# Altium schematic sheet 05.SchDoc
size 420 x 297 mm
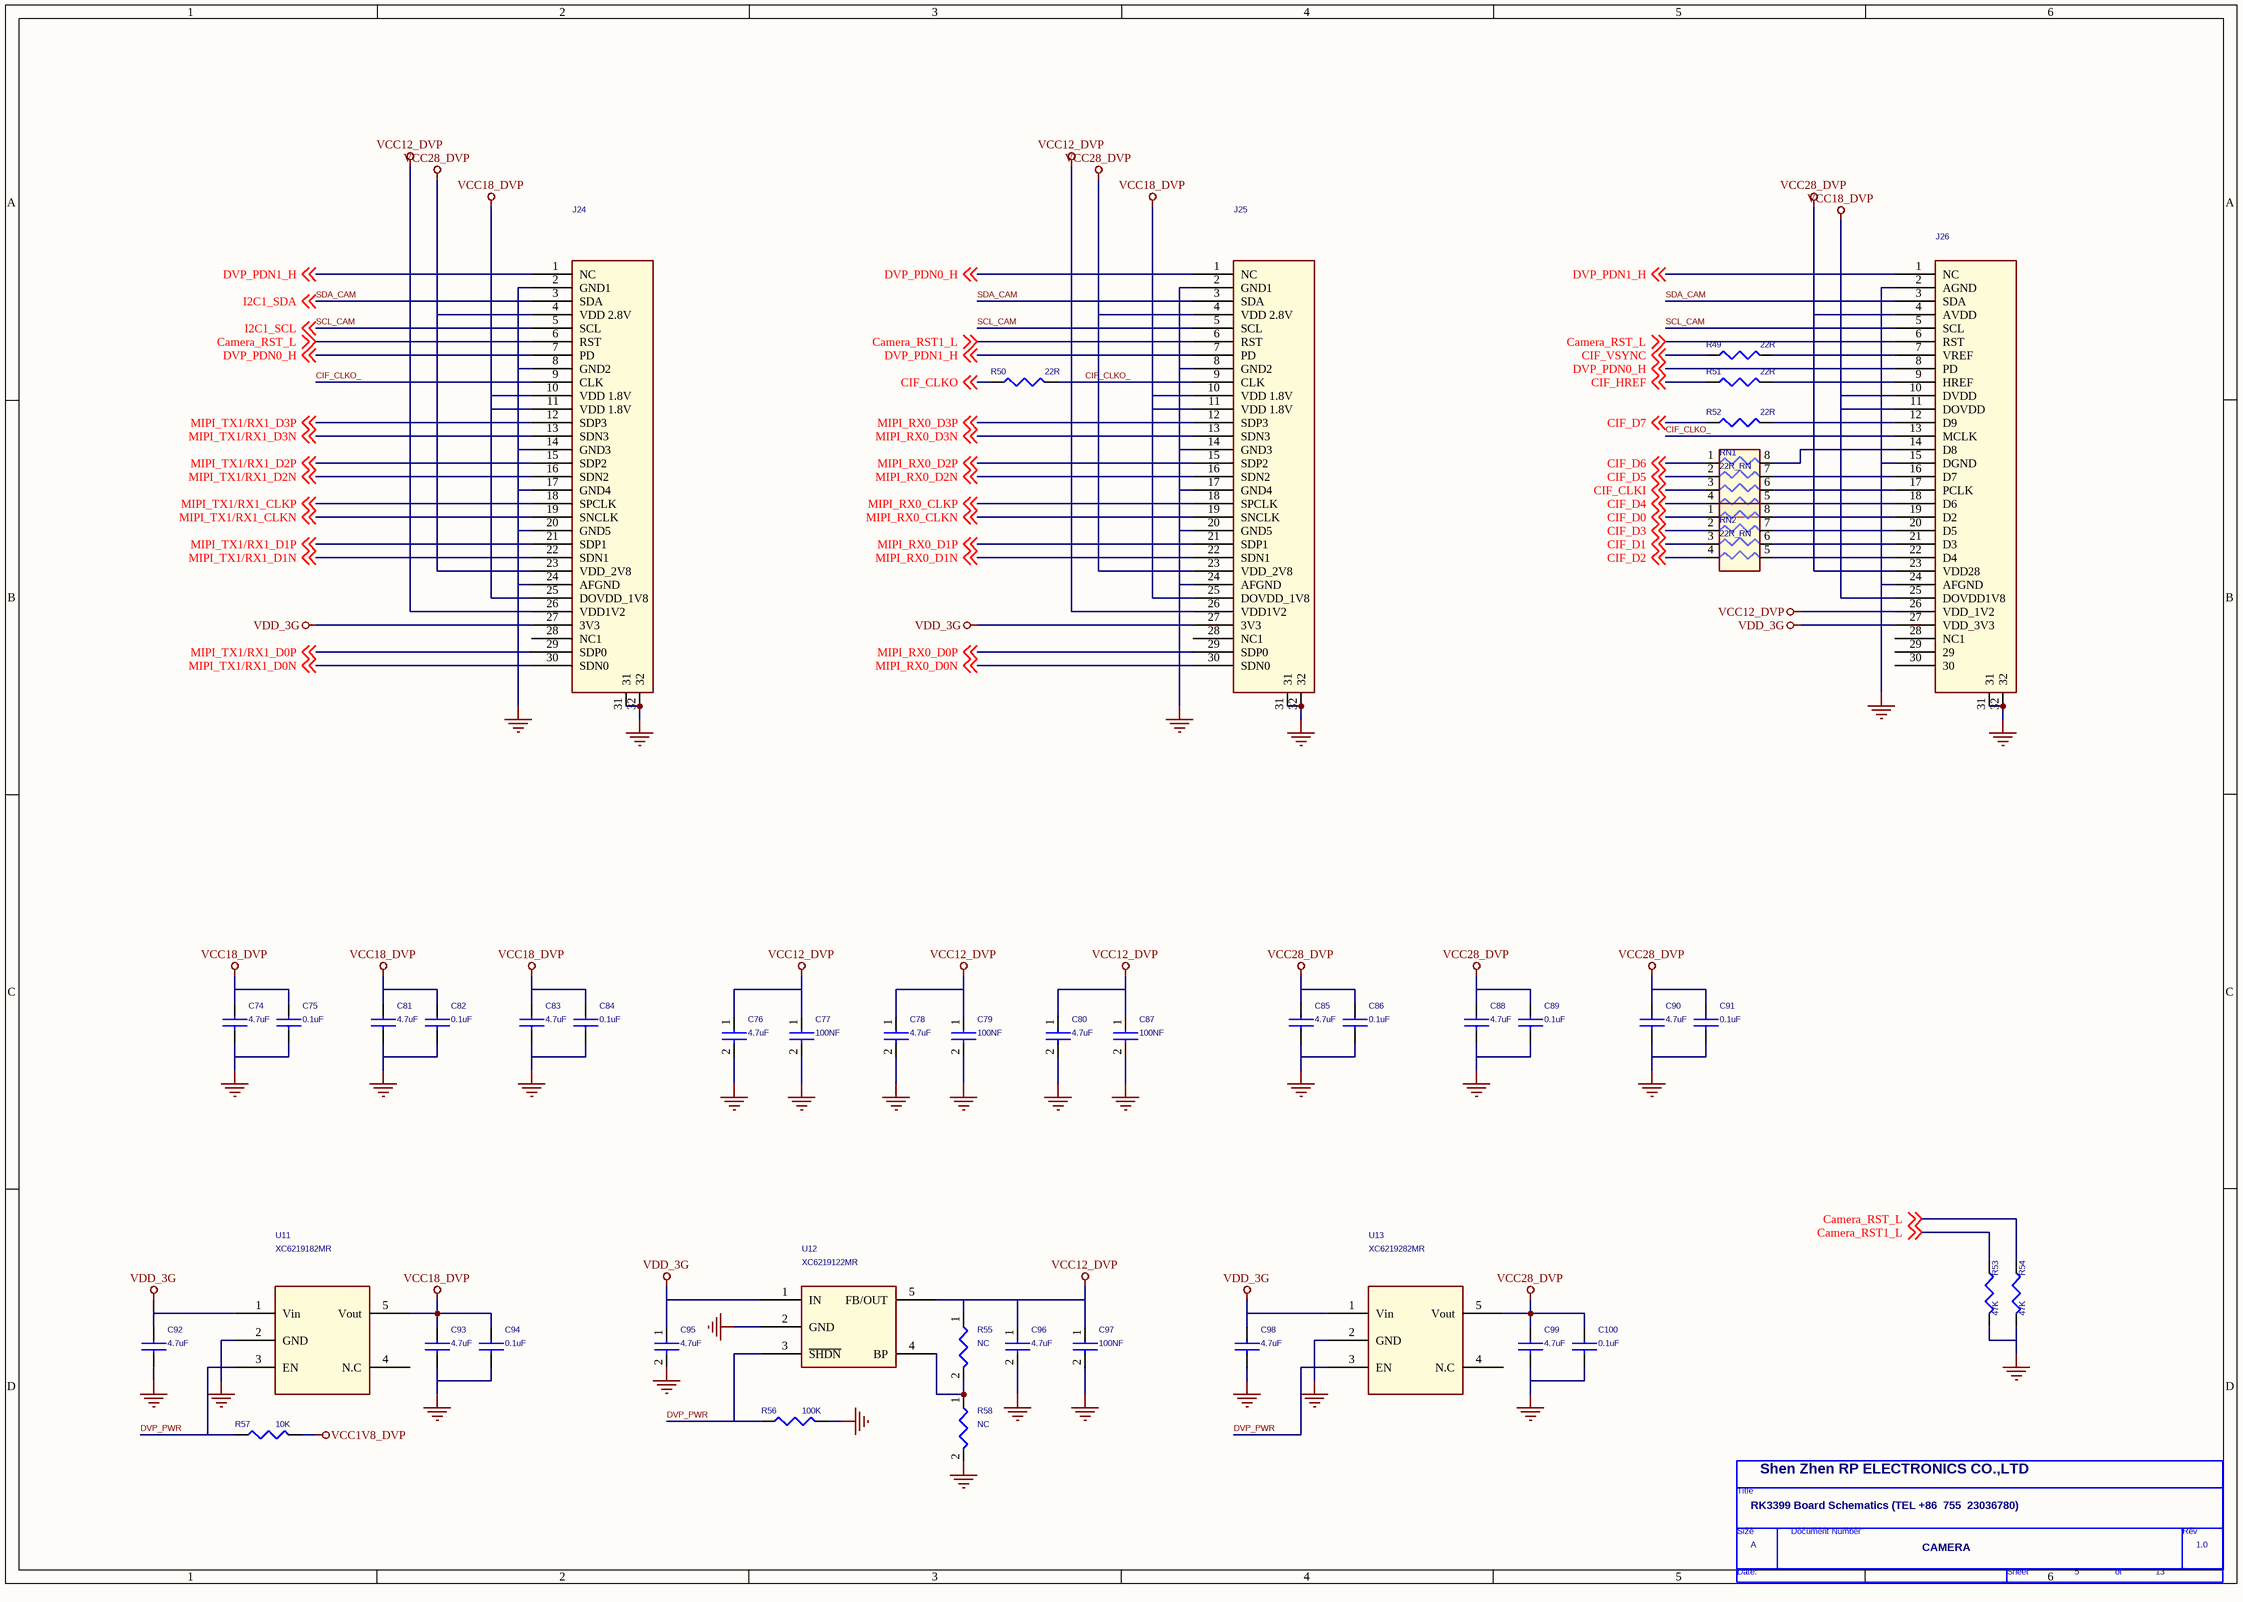
[diagram p0: 05.SchDoc]

## Parts
*  Doc: CAMERA  RevCode: 1.0  Title: RK3399 Board Schematics (TEL +86  755  23036780)  Page Size: A  Page Number: 5  Page Count: 13  Cage Code: Shen Zhen RP ELECTRONICS CO.,LTD  (hidden comment: TitleBlock0)  (graphical)
C74  4.7uF  [0402_cc]
C75  0.1uF  [0402_cc]
C76  4.7uF  [0402_cc]
C77  100NF  [0402_cc]
C78  4.7uF  [0402_cc]
C79  100NF  [0402_cc]
C80  4.7uF  [0402_cc]
C81  4.7uF  [0402_cc]
C82  0.1uF  [0402_cc]
C83  4.7uF  [0402_cc]
C84  0.1uF  [0402_cc]
C85  4.7uF  [0402_cc]
C86  0.1uF  [0402_cc]
C87  100NF  [0402_cc]
C88  4.7uF  [0402_cc]
C89  0.1uF  [0402_cc]
C90  4.7uF  [0402_cc]
C91  0.1uF  [0402_cc]
C92  4.7uF  [0402_cc]
C93  4.7uF  [0402_cc]
C94  0.1uF  [0402_cc]
C95  4.7uF  [0402_cc]
C96  4.7uF  [0402_cc]
C97  100NF  [0402_cc]
C98  4.7uF  [0402_cc]
C99  4.7uF  [0402_cc]
C100  0.1uF  [0402_cc]
J24  CAM-F  [FPC28_MICRO]  (value not drawn)
J25  CAM-M  [FPC28_MICRO]  (value not drawn)
J26  FPC30P  [FPC28_MICRO]  (value not drawn)
R49  22R  [0402_cc]
R50  22R  [0402_cc]
R51  22R  [0402_cc]
R52  22R  [0402_cc]
R53  47K  [0402_cc]
R54  47K  [0402_cc]
R55  NC  [R0402]
R56  100K  [0402_cc]
R57  10K  [0402_cc]
R58  NC  [R0402]
RN1  22R_RN  [R0402S4]
RN2  22R_RN  [R0402S4]
U11  XC6219182MR  [SOT23-5]
U12  XC6219122MR  [SOT_23_5]
U13  XC6219282MR  [SOT23-5]

## Nets
GND: C74.2 C75.2 C76.2 C77.2 C78.2 C79.2 C80.2 C81.2 C82.2 C83.2 C84.2 C85.2 C86.2 C87.2 C88.2 C89.2 C90.2 C91.2 C92.2 C93.2 C94.2 C95.2 C96.2 C97.2 C98.2 C99.2 C100.2 J24.2(GND1) J24.8(GND2) J24.14(GND3) J24.17(GND4) J24.20(GND5) J24.24(AFGND) J24.31 J24.32 J25.2(GND1) J25.8(GND2) J25.14(GND3) J25.17(GND4) J25.20(GND5) J25.24(AFGND) J25.31 J25.32 J26.2(AGND) J26.15(DGND) J26.24(AFGND) J26.31 J26.32 R53.2 R54.2 R56.2 R58.2 U11.2(GND) U12.2(GND) U13.2(GND)
VCC1V8_DVP: R57.2
VCC12_DVP: C76.1 C77.1 C78.1 C79.1 C80.1 C87.1 C96.1 C97.1 J24.26(VDD1V2) J25.26(VDD1V2) J26.26(VDD_1V2) R55.1 U12.5(FB/OUT)
VCC18_DVP: C74.1 C75.1 C81.1 C82.1 C83.1 C84.1 C93.1 C94.1 J24.10(VDD_1.8V) J24.11(VDD_1.8V) J24.25(DOVDD_1V8) J25.10(VDD_1.8V) J25.11(VDD_1.8V) J25.25(DOVDD_1V8) J26.10(DVDD) J26.11(DOVDD) J26.25(DOVDD1V8) U11.5(Vout)
VCC28_DVP: C85.1 C86.1 C88.1 C89.1 C90.1 C91.1 C99.1 C100.1 J24.4(VDD_2.8V) J24.23(VDD_2V8) J25.4(VDD_2.8V) J25.23(VDD_2V8) J26.4(AVDD) J26.23(VDD28) U13.5(Vout)
VDD_3G: C92.1 C95.1 C98.1 J24.27(3V3) J25.27(3V3) J26.27(VDD_3V3) U11.1(Vin) U12.1(IN) U13.1(Vin)
Camera_RST1_L: J25.6(RST) R53.1 ; off-sheet Camera_RST1_L
Camera_RST_L: J24.6(RST) J26.6(RST) R54.1 ; off-sheet Camera_RST_L
CIF_CLKI: RN1.3 ; off-sheet CIF_CLKI
CIF_CLKO: R50.2 ; off-sheet CIF_CLKO
CIF_CLKO_: J24.9(CLK) J25.9(CLK) J26.13(MCLK) R50.1
CIF_D0: RN2.1 ; off-sheet CIF_D0
CIF_D1: RN2.3 ; off-sheet CIF_D1
CIF_D2: RN2.4 ; off-sheet CIF_D2
CIF_D3: RN2.2 ; off-sheet CIF_D3
CIF_D4: RN1.4 ; off-sheet CIF_D4
CIF_D5: RN1.2 ; off-sheet CIF_D5
CIF_D6: RN1.1 ; off-sheet CIF_D6
CIF_D7: R52.2 ; off-sheet CIF_D7
CIF_HREF: R51.2 ; off-sheet CIF_HREF
CIF_VSYNC: R49.2 ; off-sheet CIF_VSYNC
DVP_PDN0_H: J24.7(PD) J25.1(NC) J26.8(PD) ; off-sheet DVP_PDN0_H
DVP_PDN1_H: J24.1(NC) J25.7(PD) J26.1(NC) ; off-sheet DVP_PDN1_H
DVP_PWR: R56.1 R57.1 U11.3(EN) U12.3(~{SHDN}) U13.3(EN)
MIPI_RX0_CLKN: J25.19(SNCLK) ; off-sheet MIPI_RX0_CLKN
MIPI_RX0_CLKP: J25.18(SPCLK) ; off-sheet MIPI_RX0_CLKP
MIPI_RX0_D0N: J25.30(SDN0) ; off-sheet MIPI_RX0_D0N
MIPI_RX0_D0P: J25.29(SDP0) ; off-sheet MIPI_RX0_D0P
MIPI_RX0_D1N: J25.22(SDN1) ; off-sheet MIPI_RX0_D1N
MIPI_RX0_D1P: J25.21(SDP1) ; off-sheet MIPI_RX0_D1P
MIPI_RX0_D2N: J25.16(SDN2) ; off-sheet MIPI_RX0_D2N
MIPI_RX0_D2P: J25.15(SDP2) ; off-sheet MIPI_RX0_D2P
MIPI_RX0_D3N: J25.13(SDN3) ; off-sheet MIPI_RX0_D3N
MIPI_RX0_D3P: J25.12(SDP3) ; off-sheet MIPI_RX0_D3P
MIPI_TX1/RX1_CLKN: J24.19(SNCLK) ; off-sheet MIPI_TX1/RX1_CLKN
MIPI_TX1/RX1_CLKP: J24.18(SPCLK) ; off-sheet MIPI_TX1/RX1_CLKP
MIPI_TX1/RX1_D0N: J24.30(SDN0) ; off-sheet MIPI_TX1/RX1_D0N
MIPI_TX1/RX1_D0P: J24.29(SDP0) ; off-sheet MIPI_TX1/RX1_D0P
MIPI_TX1/RX1_D1N: J24.22(SDN1) ; off-sheet MIPI_TX1/RX1_D1N
MIPI_TX1/RX1_D1P: J24.21(SDP1) ; off-sheet MIPI_TX1/RX1_D1P
MIPI_TX1/RX1_D2N: J24.16(SDN2) ; off-sheet MIPI_TX1/RX1_D2N
MIPI_TX1/RX1_D2P: J24.15(SDP2) ; off-sheet MIPI_TX1/RX1_D2P
MIPI_TX1/RX1_D3N: J24.13(SDN3) ; off-sheet MIPI_TX1/RX1_D3N
MIPI_TX1/RX1_D3P: J24.12(SDP3) ; off-sheet MIPI_TX1/RX1_D3P
SCL_CAM: J24.5(SCL) J25.5(SCL) J26.5(SCL) ; off-sheet I2C1_SCL  [also labelled I2C1_SCL]
SDA_CAM: J24.3(SDA) J25.3(SDA) J26.3(SDA) ; off-sheet I2C1_SDA  [also labelled I2C1_SDA]
NetJ26_7: J26.7(VREF) R49.1
NetJ26_9: J26.9(HREF) R51.1
NetJ26_12: J26.12(D9) R52.1
NetJ26_14: J26.14(D8) RN1.8
NetJ26_16: J26.16(D7) RN1.7
NetJ26_17: J26.17(PCLK) RN1.6
NetJ26_18: J26.18(D6) RN1.5
NetJ26_19: J26.19(D2) RN2.8
NetJ26_20: J26.20(D5) RN2.7
NetJ26_21: J26.21(D3) RN2.6
NetJ26_22: J26.22(D4) RN2.5
NetR55_2: R55.2 R58.1 U12.4(BP)

Not connected (* = marked no-connect by the designer): J24 28(NC1); J25 28(NC1); J26 28(NC1) 29 30; U11 4(N.C); U13 4(N.C)

## Notes on the sheet
- (in symbol TitleBlock0) Title; Size; Document Number; Rev; Date:; Sheet; of

## Library data of the parts
C74 C75 C81-C86 C88-C94 C98-C100 = CAP NP_Dup8
C76 C78 C80 C95 = CAP NP_Dup2: cap,4.70uF,+/-10%,10V,X5R,C0603; Manufacturer: TDK; RK PN: C1608X5R1A475K080AC; Priority: A; Tolerance: 10%; Manufacturer PN: C1608X5R1A475K080AC
C77 C79 C87 = CAP NP_Dup2: cap,100.00nF,+/-10%,16V,X5R,C0402; Manufacturer PN: C1005X5R1C104K050BA; Manufacturer: TDK; Tolerance: 10%; Priority: A; RK PN: C1005X5R1C104K050BA
C96 = CAP NP_Dup2: cap,4.70uF,+/-10%,10V,X5R,C0603; Manufacturer PN: C1608X5R1A475K080AC; Manufacturer: TDK; Tolerance: 10%; Priority: A; RK PN: C1608X5R1A475K080AC
C97 = CAP NP_Dup2: cap,100.00nF,+/-10%,16V,X5R,C0402; Manufacturer: TDK; RK PN: C1005X5R1C104K050BA; Priority: A; Tolerance: 10%; Manufacturer PN: C1005X5R1C104K050BA
J24 J25 = CAM28P_4
J26 = CAM28P_3
R49-R52 = R_Dup1
R53 R54 R56 R57 = RESISTOR_0_Dup1
R55 = RESISTOR_Dup1: 通用厚膜电阻,10K,+/-1%,R0402,1/16W.; Manufacturer PN: RC0402FR-0710KL; Manufacturer: YAGEO; Tolerance: 1%; Wattage: 1/16W; Priority: A; RK PN: RC0402FR-0710KL
R58 = RESISTOR_Dup1: 通用厚膜电阻,82K,+/-1%,R0402,1/16W.; Manufacturer: YAGEO; Tolerance: 1%; RK PN: RC0402FR-0782KL; Priority: A; Wattage: 1/16W; Manufacturer PN: RC0402FR-0782KL
RN1 RN2 = RESARR_IS_4/SO
U11 U13 = XC6219_2
U12 = LDO_TT2102: TT2102是输出电压可调、高纹波抑制率、低功耗、低压差，具有过流和短路保护的CMOS 降压型电压稳压器。输出范围：0.8V-5.0V。300mA输出电流。; Manufacturer PN: TT2102; Manufacturer: T&T; Priority: A; Option: CE8805; RK PN: TT2102
* = TitleBlock0: Page Create Date: March  8, 1995